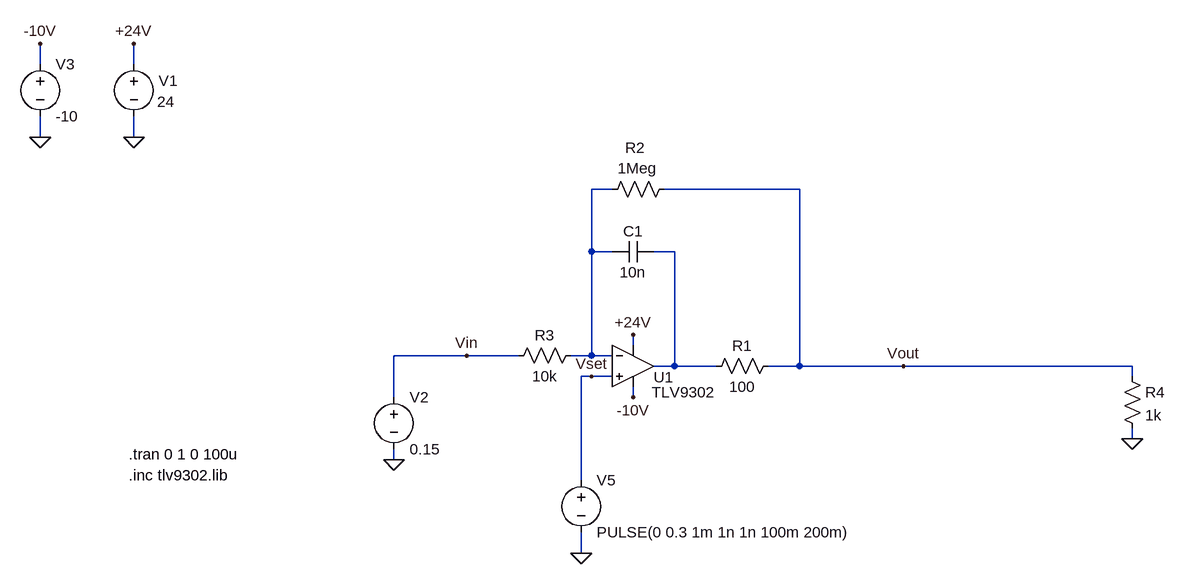
[diagram p0: schematic inverting_integrator_amp.asc]
inverting_integrator_amp.asc, the LTspice schematic file:
Version 4
SHEET 1 1032 680
WIRE -704 -304 -704 -336
WIRE -560 -304 -560 -336
WIRE -704 -192 -704 -224
WIRE -560 -192 -560 -224
WIRE 176 -112 144 -112
WIRE 464 -112 256 -112
WIRE 144 -16 144 -112
WIRE 176 -16 144 -16
WIRE 272 -16 240 -16
WIRE 208 128 208 112
WIRE -48 144 -160 144
WIRE 32 144 -48 144
WIRE 144 144 144 -16
WIRE 144 144 112 144
WIRE 176 144 144 144
WIRE 272 160 272 -16
WIRE 272 160 240 160
WIRE 336 160 272 160
WIRE 464 160 464 -112
WIRE 464 160 416 160
WIRE 624 160 464 160
WIRE 976 160 624 160
WIRE 144 176 128 176
WIRE 176 176 144 176
WIRE 976 176 976 160
WIRE -160 208 -160 144
WIRE 208 208 208 192
WIRE 976 272 976 256
WIRE -160 304 -160 288
WIRE 128 336 128 176
WIRE 128 448 128 416
FLAG -560 -336 +24V
FLAG -560 -192 0
FLAG 208 112 +24V
FLAG -160 304 0
FLAG -704 -192 0
FLAG -704 -336 -10V
FLAG 208 208 -10V
FLAG 624 160 Vout
FLAG -48 144 Vin
FLAG 976 272 0
FLAG 128 448 0
FLAG 144 176 Vset
SYMBOL OpAmps\\opamp2 208 96 R0
WINDOW 0 32 81 Left 2
WINDOW 3 29 104 Left 2
SYMATTR InstName U1
SYMATTR Value TLV9302
SYMBOL voltage -560 -320 R0
WINDOW 0 38 41 Left 2
WINDOW 3 36 73 Left 2
WINDOW 123 0 0 Left 0
WINDOW 39 0 0 Left 0
SYMATTR InstName V1
SYMATTR Value 24
SYMBOL cap 240 -32 R90
WINDOW 0 0 32 VBottom 2
WINDOW 3 32 32 VTop 2
SYMATTR InstName C1
SYMATTR Value 10n
SYMBOL res 432 144 R90
WINDOW 0 0 56 VBottom 2
WINDOW 3 32 56 VTop 2
SYMATTR InstName R1
SYMATTR Value 100
SYMBOL res 272 -128 R90
WINDOW 0 -32 61 VBottom 2
WINDOW 3 -32 57 VTop 2
SYMATTR InstName R2
SYMATTR Value 1Meg
SYMBOL voltage -704 -320 R0
WINDOW 123 0 0 Left 0
WINDOW 39 0 0 Left 0
SYMATTR InstName V3
SYMATTR Value -10
SYMBOL res 128 128 R90
WINDOW 0 0 56 VBottom 2
WINDOW 3 32 56 VTop 2
SYMATTR InstName R3
SYMATTR Value 10k
SYMBOL res 960 160 R0
SYMATTR InstName R4
SYMATTR Value 1k
SYMBOL voltage 128 320 R0
WINDOW 123 0 0 Left 0
WINDOW 39 0 0 Left 0
SYMATTR InstName V5
SYMATTR Value PULSE(0 0.3 1m 1n 1n 100m 200m)
SYMBOL voltage -160 192 R0
WINDOW 123 0 0 Left 0
WINDOW 39 0 0 Left 0
SYMATTR InstName V2
SYMATTR Value 0.15
TEXT -568 328 Left 2 !.inc tlv9302.lib
TEXT -568 296 Left 2 !.tran 0 1 0 100u

The netlist it stands for:
* inverting_integrator_amp.asc
XU1 Vset N001 +24V -10V N002 TLV9302  ; pins In+ In- V+ V- OUT
V1 +24V 0 24
C1 N002 N001 10n
R1 Vout N002 100
R2 Vout N001 1Meg
V3 -10V 0 -10
R3 N001 Vin 10k
R4 Vout 0 1k
V5 Vset 0 PULSE(0 0.3 1m 1n 1n 100m 200m)
V2 Vin 0 0.15
.inc tlv9302.lib
.tran 0 1 0 100u
.backanno
.end